# EAGLE schematic HouseSchematic (EAGLE 7.5.0)
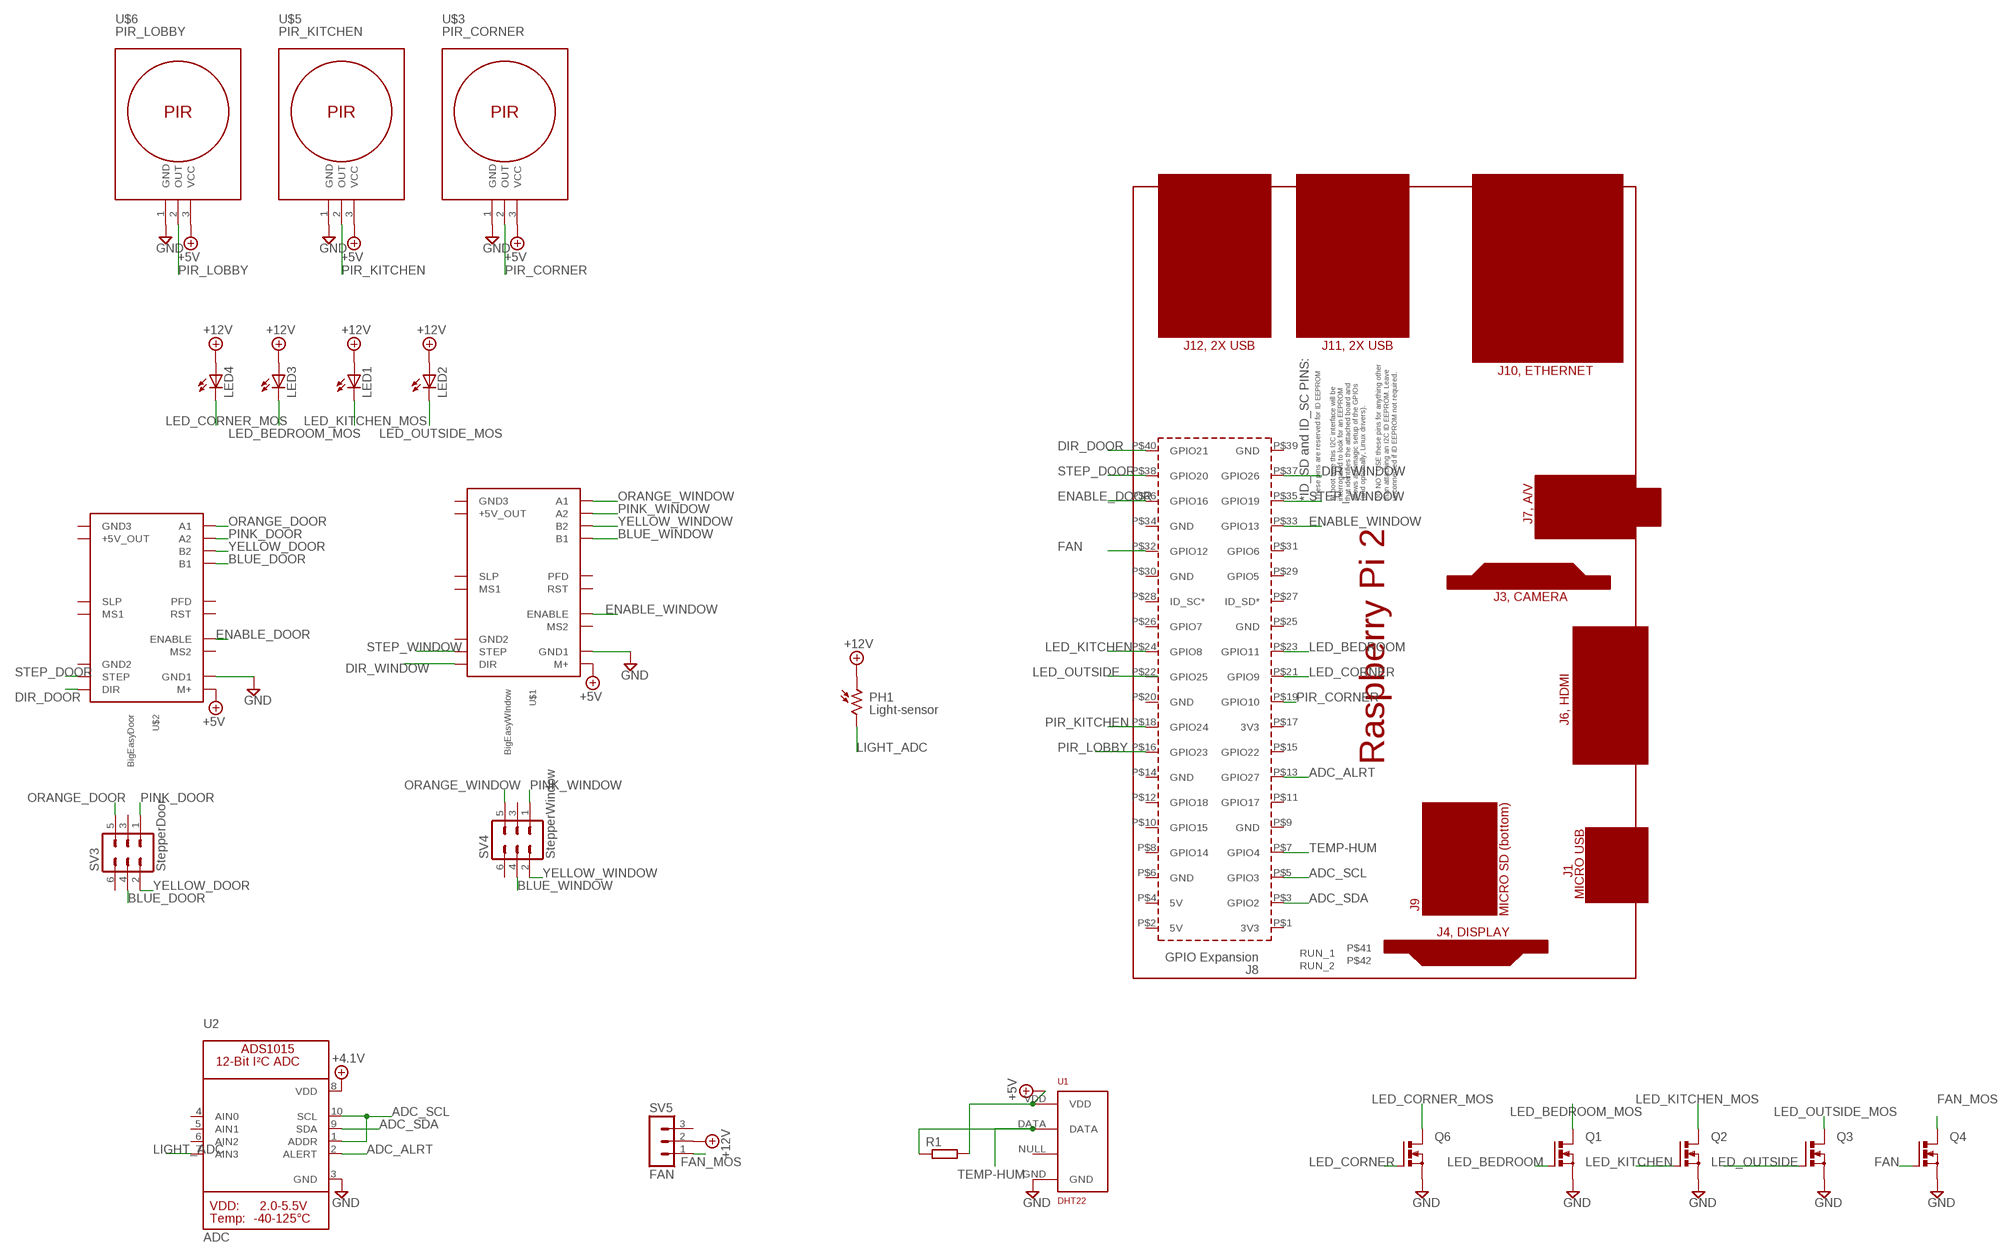
[diagram p0: schematic, sheet 1]

## Parts
LED1  LED5MM  [LED5MM]
LED2  LED5MM  [LED5MM]
LED3  LED5MM  [LED5MM]
LED4  LED5MM  [LED5MM]
PCB1  RPI2  [RPI2]
PH1  Light-sensor  V1060_21  [TO-5_V10]
Q1  PMOSFET_NTO220BH  [TO220BH]
Q2  PMOSFET_NTO220BH  [TO220BH]
Q3  PMOSFET_NTO220BH  [TO220BH]
Q4  PMOSFET_NTO220BH  [TO220BH]
Q6  PMOSFET_NTO220BH  [TO220BH]
R1  R-EU_0204/2V  [0204V]
SV3  StepperDoor  MA03-2  [MA03-2]
SV4  StepperWindow  MA03-2  [MA03-2]
SV5  FAN  MA03-1  [MA03-1]
U1  DHT22  RHT03_DHT-22_AM2302RA  [RHT03_DHT-22/RA]
U2  ADC  ADC_ADS1015  [MSOP10]
U$1  BigEasyWIndow  EASYDRIVER_V44  [EASYDRIVER_V44]
U$2  BigEasyDoor  EASYDRIVER_V44  [EASYDRIVER_V44]
U$3  PIR_CORNER  MOTION-PIR-DYP-ME003  [MOTION-PIR-DYP-ME003]
U$5  PIR_KITCHEN  MOTION-PIR-DYP-ME003  [MOTION-PIR-DYP-ME003]
U$6  PIR_LOBBY  MOTION-PIR-DYP-ME003  [MOTION-PIR-DYP-ME003]

## Nets
+4.1V: U2.8(VDD)
+5V: R1.2 U1.VDD U$2.M+ U$3.3(VCC) U$5.3(VCC) U$6.3(VCC)
+12V: LED1.A LED2.A LED3.A LED4.A PH1.1 SV5.2
ADC_ALRT: PCB1.P$13(GPIO27) U2.2(ALERT)
ADC_SCL: PCB1.P$5(GPIO3) U2.1(ADDR) U2.10(SCL)
ADC_SDA: PCB1.P$3(GPIO2) U2.9(SDA)
BLUE_DOOR: SV3.4 U$2.B1
BLUE_WINDOW: SV4.4 U$1.B1
DIR_DOOR: PCB1.P$40(GPIO21) U$2.DIR
DIR_WINDOW: PCB1.P$37(GPIO26) U$1.DIR
ENABLE_DOOR: PCB1.P$36(GPIO16) U$2.ENABLE
ENABLE_WINDOW: PCB1.P$33(GPIO13) U$1.ENABLE
FAN: PCB1.P$32(GPIO12) Q4.G
FAN_MOS: Q4.D SV5.1
GND: Q1.S Q2.S Q3.S Q4.S Q6.S U1.GND U2.3(GND) U$1.GND1 U$1.M+ U$2.GND1 U$3.1(GND) U$5.1(GND) U$6.1(GND) ; supply symbol labelled +5V
LED_BEDROOM: PCB1.P$23(GPIO11) Q1.G
LED_BEDROOM_MOS: LED3.K(C) Q1.D
LED_CORNER: PCB1.P$21(GPIO9) Q6.G
LED_CORNER_MOS: LED4.K(C) Q6.D
LED_KITCHEN: PCB1.P$24(GPIO8) Q2.G
LED_KITCHEN_MOS: LED1.K(C) Q2.D
LED_OUTSIDE: Q3.G
LED_OUTSIDE_MOS: LED2.K(C) Q3.D
LIGHT_ADC: PH1.2 U2.7(AIN3)
ORANGE_DOOR: SV3.5 U$2.A1
ORANGE_WINDOW: SV4.5 U$1.A1
PINK_DOOR: SV3.1 U$2.A2
PINK_WINDOW: SV4.1 U$1.A2
PIR_CORNER: PCB1.P$19(GPIO10) U$3.2(OUT)
PIR_KITCHEN: PCB1.P$18(GPIO24) U$5.2(OUT)
PIR_LOBBY: PCB1.P$16(GPIO23) U$6.2(OUT)
STEP_DOOR: PCB1.P$38(GPIO20) U$2.STEP
STEP_WINDOW: PCB1.P$35(GPIO19) U$1.STEP
TEMP-HUM: PCB1.P$7(GPIO4) R1.1 U1.DATA
YELLOW_DOOR: SV3.2 U$2.B2
YELLOW_WINDOW: SV4.2 U$1.B2
Unconnected: PCB1.P$1(3V3) PCB1.P$2(5V) PCB1.P$4(5V) PCB1.P$6(GND) PCB1.P$8(GPIO14) PCB1.P$9(GND) PCB1.P$10(GPIO15) PCB1.P$11(GPIO17) PCB1.P$12(GPIO18) PCB1.P$14(GND) PCB1.P$15(GPIO22) PCB1.P$17(3V3) PCB1.P$20(GND) PCB1.P$22(GPIO25) PCB1.P$25(GND) PCB1.P$26(GPIO7) PCB1.P$27(ID_SD*) PCB1.P$28(ID_SC*) PCB1.P$29(GPIO5) PCB1.P$30(GND) PCB1.P$31(GPIO6) PCB1.P$34(GND) PCB1.P$39(GND) PCB1.P$41(RUN_1) PCB1.P$42(RUN_2) SV3.3 SV3.6 SV4.3 SV4.6 SV5.3 U1.NULL U2.4(AIN0) U2.5(AIN1) U2.6(AIN2) U$1.GND2 U$1.GND3 U$1.MS1 U$1.MS2 U$1.P$11(+5V_OUT) U$1.PFD U$1.RST U$1.SLEEP(SLP) U$2.GND2 U$2.GND3 U$2.MS1 U$2.MS2 U$2.P$11(+5V_OUT) U$2.PFD U$2.RST U$2.SLEEP(SLP)

## Library data of the parts
LED1-LED4 = led:LED: LED OSRAM: - CHIPLED LG R971, LG N971, LY N971, LG Q971, LY Q971, LO R971, LY R971 LH N974, LH R974 LS Q976, LO Q976, LY Q976 LO Q996 - Hyper CHIPLED LW Q18S LB Q993, LB Q99A, LB R99A - SideLED LS A670, LO A670, LY A670, LG A670, LP A670 LB A673, LV A673, LT A673, LW A673 LH A674 LY A675 LS A676, LA A676, LO A676, LY A676, LW A676 LS A679, LY A679, LG A679 - Hyper Micro SIDELED® LS Y876, LA Y876, LO Y876, LY Y876 LT Y87S - SmartLED LW L88C, LW L88S LB L89C, LB L89S, LG L890 LS L89K, LO L89K, LY L89K LS L896, LA L896, LO L896, LY L896 - TOPLED LS T670, LO T670, LY T670, LG T670, LP T670 LSG T670, LSP T670, LSY T670, LOP T670, LYG T670 LG T671, LOG T671, LSG T671 LB T673, LV T673, LT T673, LW T673 LH T674 LS T676, LA T676, LO T676, LY T676, LB T676, LH T676, LSB T676, LW T676 LB T67C, LV T67C, LT T67C, LS T67K, LO T67K, LY T67K, LW E67C LS E67B, LA E67B, LO E67B, LY E67B, LB E67C, LV E67C, LT E67C LW T67C LS T679, LY T679, LG T679 LS T770, LO T770, LY T770, LG T770, LP T770 LB T773, LV T773, LT T773, LW T773 LH T774 LS E675, LA E675, LY E675, LS T675 LS T776, LA T776, LO T776, LY T776, LB T776 LHGB T686 LT T68C, LB T68C - Hyper Mini TOPLED® LB M676 - Mini TOPLED Santana® LG M470 LS M47K, LO M47K, LY M47K Source: http://www.osram.convergy.de LUXEON: - LUMILED® LXK2-PW12-R00, LXK2-PW12-S00, LXK2-PW14-U00, LXK2-PW14-V00 LXK2-PM12-R00, LXK2-PM12-S00, LXK2-PM14-U00 LXK2-PE12-Q00, LXK2-PE12-R00, LXK2-PE12-S00, LXK2-PE14-T00, LXK2-PE14-U00 LXK2-PB12-K00, LXK2-PB12-L00, LXK2-PB12-M00, LXK2-PB14-N00, LXK2-PB14-P00, LXK2-PB14-Q00 LXK2-PR12-L00, LXK2-PR12-M00, LXK2-PR14-Q00, LXK2-PR14-R00 LXK2-PD12-Q00, LXK2-PD12-R00, LXK2-PD12-S00 LXK2-PH12-R00, LXK2-PH12-S00 LXK2-PL12-P00, LXK2-PL12-Q00, LXK2-PL12-R00 Source: www.luxeon.com KINGBRIGHT: KA-3528ASYC Source: www.kingbright.com
PCB1 = RaspberryPi2_RevA:RPI2: Device for Raspberry Pi 2 board created by www.element14.com More information and support community is available at http://www.element14.com/community/community/raspberry-pi/raspberrypi2
PH1 = photo-elements:?1060*: Sensor Street Light control Source: http://optoelectronics.perkinelmer.com/content/Datasheets/DTS_PhotocellsB1060.pdf
Q1-Q4 Q6 = transistor-power:PMOSFET_N: Power MOSFET N-Channel
R1 = rcl:R-EU_: RESISTOR, European symbol
SV3 SV4 = con-lstb:MA03-2: PIN HEADER; OC_FARNELL: unknown; OC_NEWARK: unknown
SV5 = con-lstb:MA03-1: PIN HEADER; OC_FARNELL: unknown; OC_NEWARK: unknown
U1 = RHT03_DHT-22_AM2302:RHT03_DHT-22_AM2302: RHT03 / DHT-22 / AM2302 Packages and symbol for the RHT03 / DHT-22 relative humidity and temperature sensor. Note: The AM2302 is a wired version of the DHT-22 which typically requires less clearance and is thus provided as a separate package.; PROD_ID: SEN-10167
U2 = ads1115:ADC_ADS1015: ADS1015 - 12-bit 4-Channel I2C ADC with Internal PGA VDD: 2.0-5.5V Sampling Rate: 3.3ksps Gain Settings: 2/3, 1, 2, 4, 8, 16 I2C Address: ADDR low = 1001000x, ADDR high = 1001001x Internal Comparator The ADS1015 includes an internal comparator that can be set to output a high-level on ALERT when the conversion results exceeeds a pre-defined upper level, and will deassert itself when the level falls below a pre-defined lower threshold level. It can also be set to windowed mode where the ALERT pin will be asserted if the data exceeds the upper threshold or falls below the lower threshold.
U$1 U$2 = BigEasyDriver:EASYDRIVER_V44: EasyDriver version 4.4 - http://www.schmalzhaus.com/EasyDriver
U$3 U$5 U$6 = diy-modules:MOTION-PIR-DYP-ME003: PIR Motion Sensor Module DYP-ME003 based on BISS0001 pyroelectic detector